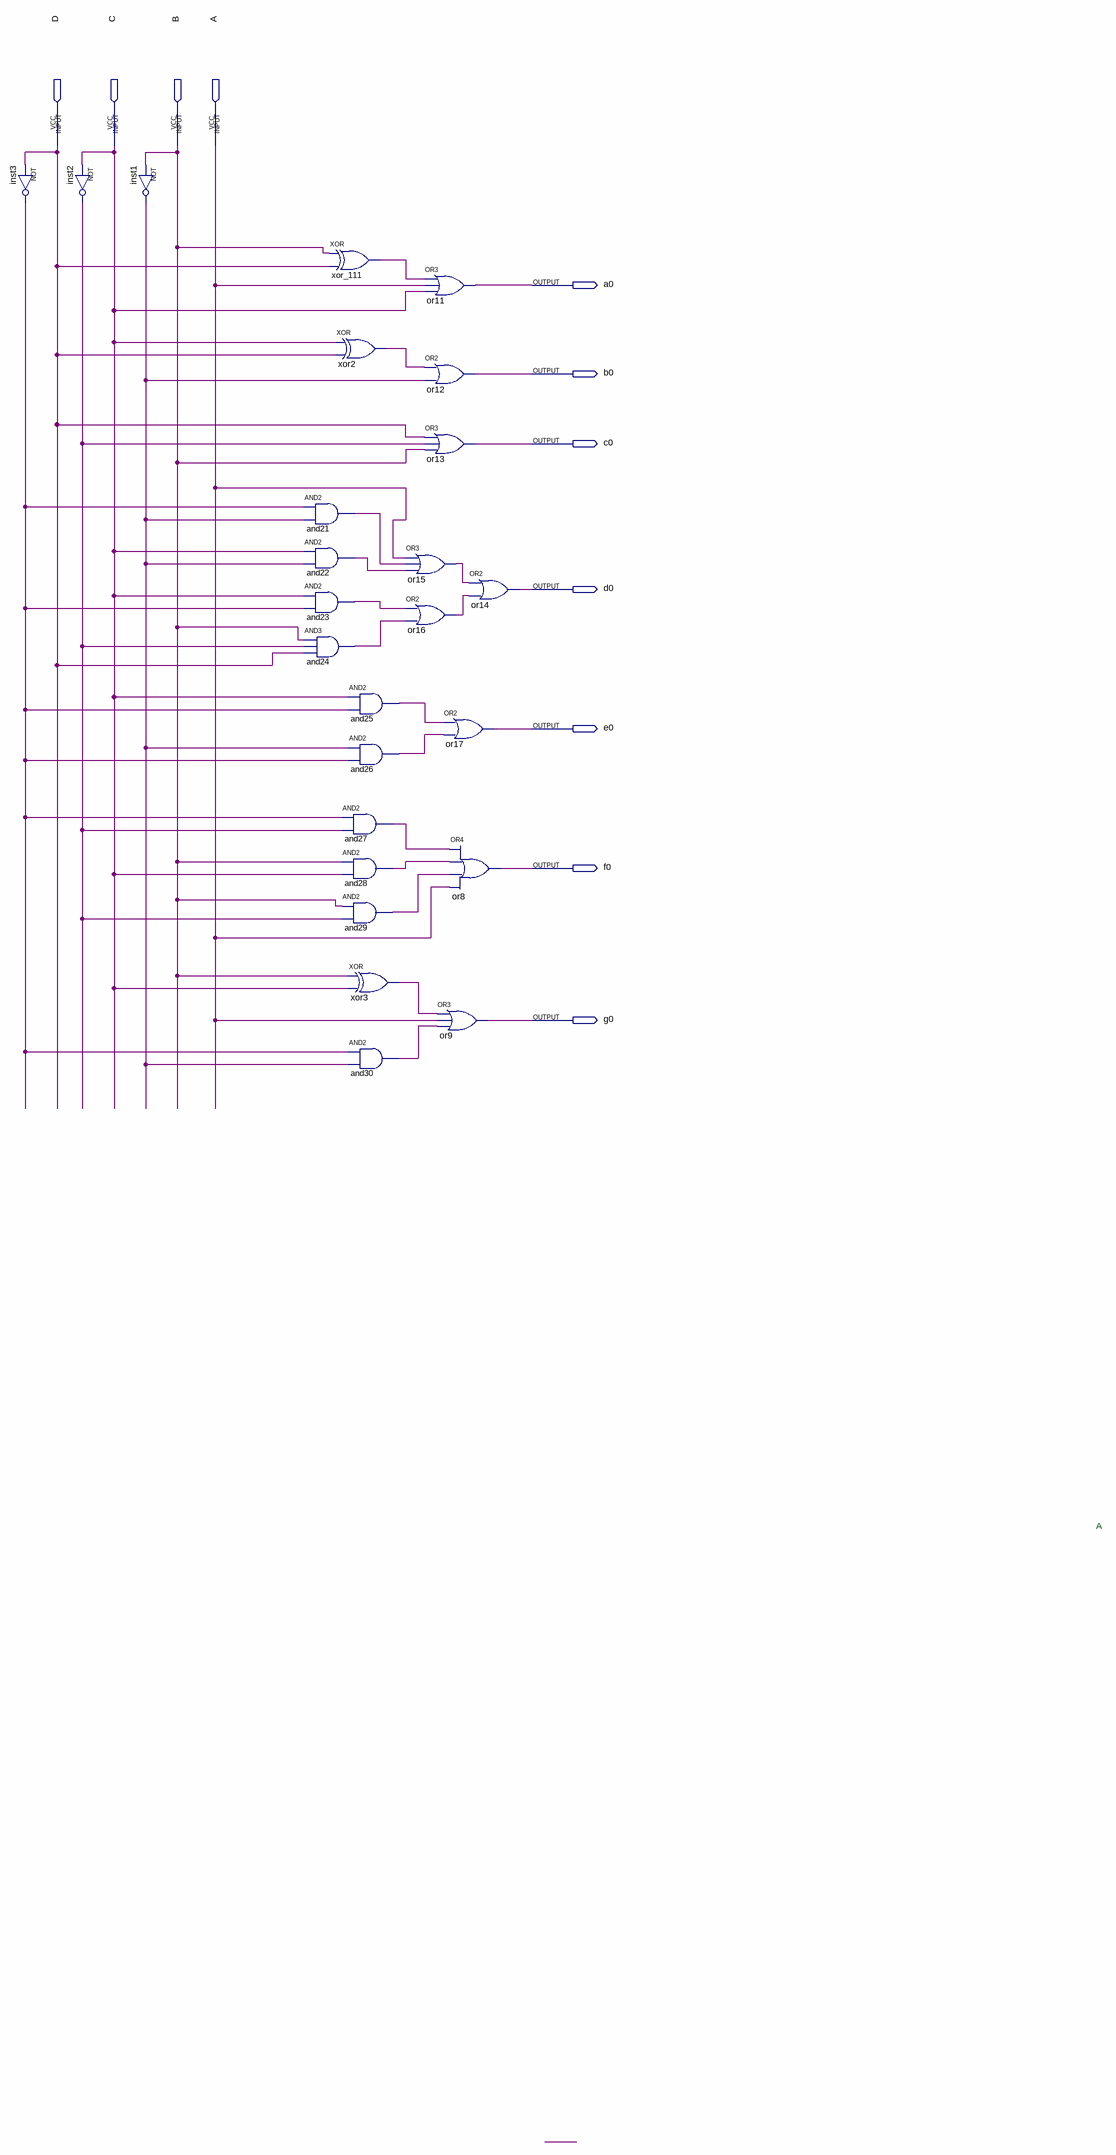
[diagram p0: schematic sheet]
// Quartus schematic Teste1.bdf as structural Verilog: 25 symbols, 11 pins
module Teste1 (
  input  D,
  input  C,
  input  B,
  input  A,
  output a0,
  output b0,
  output c0,
  output d0,
  output e0,
  output f0,
  output g0
);

  wire and21_out, and22_out, and23_out, and24_out, and25_out, and26_out, and27_out, and28_out, and29_out,
       and30_out, inst1_out, inst2_out, inst3_out, or15_out, or16_out, xor2_out, xor3_out, xor_111_out;

  not inst3 (inst3_out, D);
  not inst2 (inst2_out, C);
  not inst1 (inst1_out, B);
  xor xor_111 (xor_111_out, B, D);
  and and21 (and21_out, inst3_out, inst1_out);
  and and22 (and22_out, C, inst1_out);
  and and23 (and23_out, C, inst3_out);
  and and24 (and24_out, B, inst2_out, D);
  xor xor2 (xor2_out, C, D);
  and and25 (and25_out, C, inst3_out);
  and and26 (and26_out, inst1_out, inst3_out);
  and and27 (and27_out, inst3_out, inst2_out);
  and and28 (and28_out, B, C);
  and and29 (and29_out, B, inst2_out);
  xor xor3 (xor3_out, B, C);
  and and30 (and30_out, inst3_out, inst1_out);
  or or11 (a0, xor_111_out, A, C);
  or or12 (b0, xor2_out, inst1_out);
  or or13 (c0, D, inst2_out, B);
  or or15 (or15_out, A, and21_out, and22_out);
  or or16 (or16_out, and23_out, and24_out);
  or or14 (d0, or15_out, or16_out);
  or or17 (e0, and25_out, and26_out);
  or or8 (f0, and27_out, and28_out, and29_out, A);
  or or9 (g0, xor3_out, A, and30_out);

  // Notes on the sheet:
  //   A
endmodule
